# EAGLE design FabOptimusEdited (EAGLE 9.5.2)
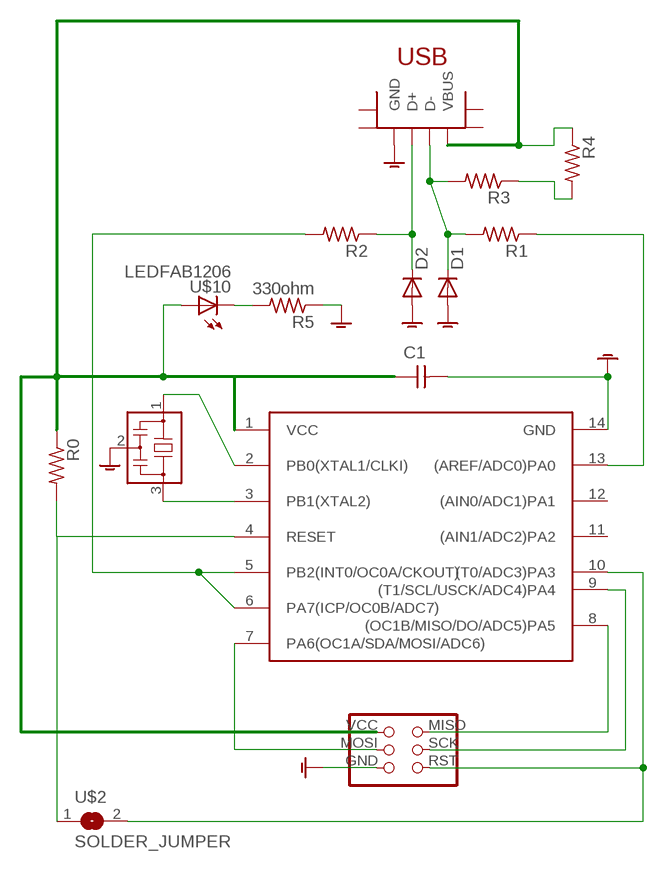
[diagram p0: schematic, sheet 1]

## Parts
C1  CAP-UNPOLARIZEDFAB  [C1206FAB]
D1  DIODESOD123  [SOD123]
D2  DIODESOD123  [SOD123]
IC1  ATTINY44-SSU  [SOIC14_ATTTINY44]
JP1  2X3PINHEADER  [2X3PINHEADER]
R0  RES-US1206FAB  [R1206FAB]
R1  RES-US1206FAB  [R1206FAB]
R2  RES-US1206FAB  [R1206FAB]
R3  RES-US1206FAB  [R1206FAB]
R4  RES-US1206FAB  [R1206FAB]
R5  330ohm  RES-US1206FAB  [R1206FAB]
U$1  RESONATOR  [EFOBM]
U$2  SOLDER_JUMPER  [SOLDERJUMPER]
U$8  USB_MINIB  [USB_MINIB]
U$10  LEDFAB1206  [LED1206FAB]

## Nets
GND: C1.2 D1.ANODE(A) D2.ANODE(A) IC1.14(GND) JP1.GND R5.1 U$1.2 U$8.GND
N$1: IC1.2(PB0(XTAL1/CLKI)) U$1.1
N$2: D2.CATHODE(C) R2.1 U$8.D+
N$3: IC1.9((T1/SCL/USCK/ADC4)PA4) JP1.SCK
N$4: D1.CATHODE(C) R1.2 R3.2 U$8.D-
N$5: IC1.7(PA6(OC1A/SDA/MOSI/ADC6)) JP1.MOSI
N$6: IC1.5(PB2(INT0/OC0A/CKOUT)) IC1.6(PA7(ICP/OC0B/ADC7)) R2.2
N$7: IC1.3(PB1(XTAL2)) U$1.3
N$8: IC1.13((AREF/ADC0)PA0) R1.1
N$9: IC1.8((OC1B/MISO/DO/ADC5)PA5) JP1.MISO
N$10: IC1.10((T0/ADC3)PA3) JP1.RST U$2.2
N$11: IC1.4(RESET) R0.2 U$2.1
N$12: R3.1 R4.2
N$14: R5.2 U$10.2(C)
R4: C1.1 IC1.1(VCC) JP1.VCC R0.1 R4.1 U$8.V(VBUS) U$10.1(A)
Unconnected: IC1.11((AIN1/ADC2)PA2) IC1.12((AIN0/ADC1)PA1) U$8.SHIELD@1(SHIELD) U$8.SHIELD@2(SHIELD1) U$8.SHIELD@3(SHIELD2) U$8.SHIELD@4(SHIELD3)

## Library data of the parts
C1 = fab:CAP-UNPOLARIZED
D1 D2 = fab:DIODE: DIODE high speed (Philips)
IC1 = myFab:ATTINY44
JP1 = myFab:2X3PINHEADER: PIN HEADER
R0 R1-R5 = fab:RES-US: Resistor (US Symbol) Variants with postfix FAB are widened to allow the routing of internal traces
U$1 = fab:RESONATOR
U$2 = myFab:SOLDER_JUMPER
U$8 = myFab:USB_MINIB
U$10 = fab:LED: LED

## Board
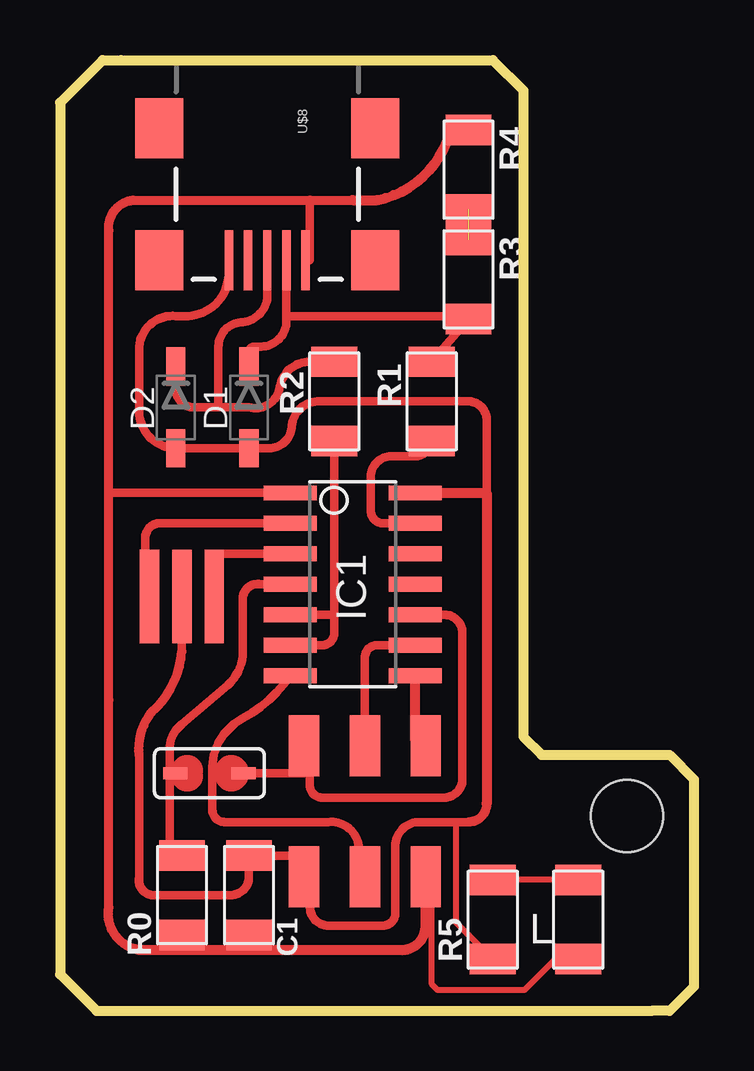
[diagram p1: board, top side]
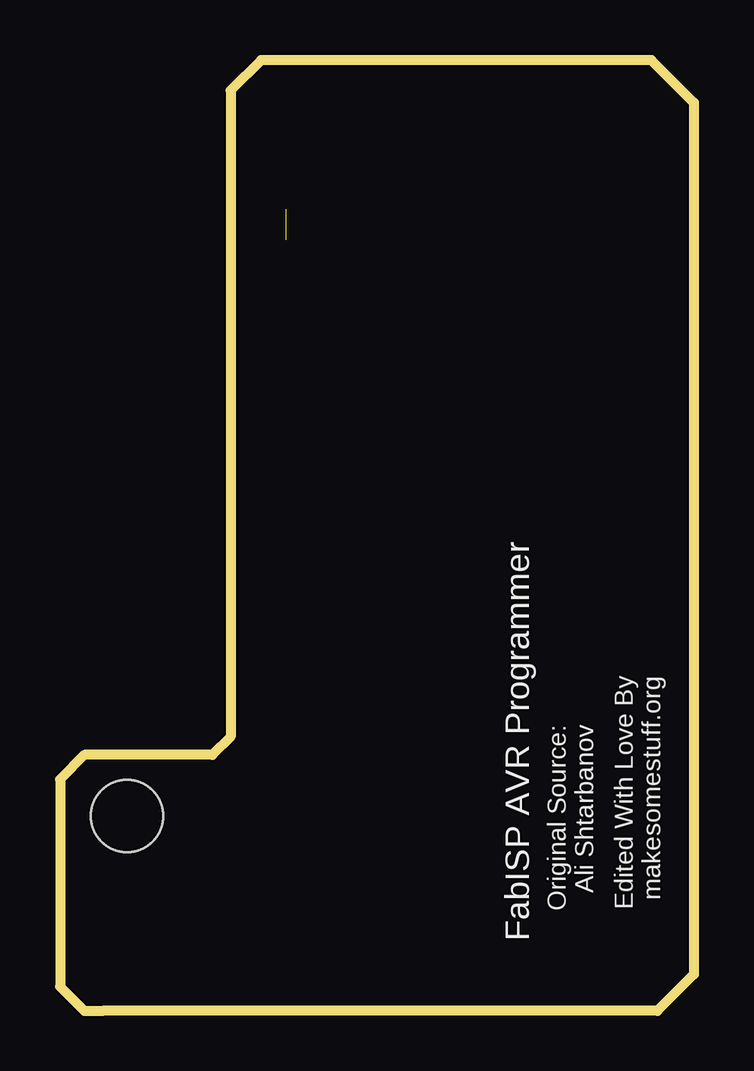
[diagram p2: board, bottom side, seen from below]

Size 26.42 x 39.62 mm. Coordinates in mm from the lower left corner, seen from the top.
Outline: 2.29,39.62 2.54,39.62
Outline: 2.54,39.62 18.03,39.62 19.3,38.35 19.3,11.43 20.07,10.67 25.4,10.67 26.42,9.65 26.42,1.02 25.4,0 24.64,0
Outline: 24.64,0 1.52,0 0,1.52 0,37.85 1.78,39.62 2.54,39.62
Outline: 24.64,0 24.89,0
Copper layers (1*16): Top 0.035mm / dielectric 1.5mm / Bottom 0.035mm
Design rules "fabcity-designrules": minimum track width 10mil, minimum drill 32mil, track to track 16mil, track to pad 16mil, pad to pad 16mil, via to via 16mil, smd to smd 6mil, copper to edge 16mil, drill to drill 16mil, minimum pad ring 10mil, minimum via ring 8mil, stop-mask expansion 4mil, vias tented up to drill 0mil, thermal gap 16mil
Holes 3 mm at 23.62,8.13

### Footprints (pad centres in the part's own frame; a part is rotated, then mirrored left to right if it is on the bottom)
C1206FAB = smd 1.27 x 1.905: 1 -1.651,0; 2 1.651,0
SOD123 = smd 1.6 x 0.8: ANODE 1.7,0; CATHODE -1.7,0
SOIC14_ATTTINY44 = smd 2.21 x 0.61: 1 -3.873,3.81; 2 -3.873,2.54; 3 -3.873,1.27; 4 -3.873,0; 5 -3.873,-1.27; 6 -3.873,-2.54; 7 -3.873,-3.81; 8 1.333,-3.81; 9 1.333,-2.54; 10 1.333,-1.27; 11 1.333,0; 12 1.333,1.27; 13 1.333,2.54; 14 1.333,3.81
2X3PINHEADER = smd 2.54 x 1.27: GND -2.54,2.54; MISO 2.92,-2.54; MOSI -2.54,0; RST 2.92,2.54; SCK 2.92,0; VCC -2.54,-2.54
R1206FAB = smd 1.27 x 1.905: 1 -1.651,0; 2 1.651,0
EFOBM = smd 0.8 x 3.9: 1 -1.35,0; 2 0,0; 3 1.35,0
SOLDERJUMPER = smd 1.016 x 0.508: 1 -2.057,0; 2 0.787,0
USB_MINIB = smd 2.5 x 0.35: D+ 3.77,0; D- 3.77,0.8; GND 3.77,-1.6; ID 3.77,-0.8; V 3.77,1.6 | smd 2.5 x 2: SHIELD@1 -1.73,-4.5; SHIELD@2 -1.73,4.5; SHIELD@3 3.77,4.5; SHIELD@4 3.77,-4.5
LED1206FAB = smd 1.27 x 1.905: 1 -1.651,0; 2 1.651,0

### Placement (x,y rotation side)
C1  7.87,4.83 90 top
D1  7.87,25.15 270 top
D2  4.83,25.15 270 top
IC1  13.46,17.78 0 top
JP1  12.7,8.13 90 top
R0  5.08,4.83 90 top
R1  15.49,25.4 90 top
R2  11.43,25.4 270 top
R3  17.02,30.48 270 top
R4  17.02,35.05 270 top
R5  18.03,3.81 90 top
U$1  5.08,17.27 0 top
U$2  6.86,9.91 0 top
U$8  8.64,35.05 270 top
U$10  21.59,3.81 90 top

### Tracks (layer width: path | path; a pad name or v marks a point on that pad's centre or on a via)
GND
  Top 0.254: R5.1 16.51,3.68 16.51,7.87
  Top 0.356: 15.49,21.59 IC1.14 | 17.02,7.87 16.51,7.87 14.99,7.87 arc90 13.97,6.86 13.97,4.06 arc-90 13.46,3.56 11.18,3.56 arc-90 10.41,4.32 10.41,4.57 arc90 10.16,4.83 arc90 9.91,4.83 | 3.3,10.67 3.3,5.59 arc90 3.81,4.83 7.11,4.83 arc90 7.87,5.59 C1.2 10.16,6.48 JP1.GND | 17.78,21.59 17.78,24.64 arc90 17.02,25.4 10.92,25.4 arc90 9.65,24.38 arc-90 8.71,23.45 D1.ANODE D2.ANODE arc-90 3.3,24.97 3.3,27.69 arc-90 4.83,28.96 5.33,28.96 arc62 6.86,29.97 arc29 U$8.GND | 5.08,14.99 U$1.2
  Top 0.381: 17.78,8.64 arc-90 17.02,7.87 | 3.3,10.67 arc-44 3.81,12.45 arc44 5.08,14.99
  Top 0.406: 10.16,4.83 JP1.GND | 17.78,8.64 17.78,21.59 15.49,21.59
N$1
  Top 0.356: IC1.2 4.06,20.32 arc90 3.56,19.56 3.56,17.1 arc-90 U$1.1
N$2
  Top 0.356: R2.1 10.54,27.05 arc90 9.14,25.91 arc-90 7.87,25.15 6.6,25.15 | D2.CATHODE 4.83,25.91 arc90 5.59,25.15 6.6,25.15 | U$8.D+ 8.64,29.97 arc-90 7.62,28.7 arc90 6.6,27.69 6.6,25.15
N$3
  Top 0.356: JP1.SCK 12.7,14.73 arc-90 13.21,15.24 IC1.9
N$4
  Top 0.356: D1.CATHODE 7.87,27.43 arc-90 8.13,27.69 8.38,27.69 arc90 9.44,28.74 9.44,28.96 | 9.44,28.96 U$8.D- | 9.44,28.96 16.76,28.96 R3.2 R1.2
N$5
  Top 0.356: 9.14,13.97 IC1.7 arc-28 7.62,12.19 arc34 6.6,11.18 arc28 6.35,10.16 6.35,8.38 arc90 6.86,7.87 11.18,7.87 arc-90 12.45,6.86 JP1.MOSI
N$6
  Top 0.356: IC1.5 11.43,16.51 | 11.43,16.51 11.43,16 11.43,15.75 arc-90 10.92,15.24 IC1.6 | R2.2 11.43,16.51
N$7
  Top 0.356: IC1.3 6.35,19.05 6.35,17.35 arc90 U$1.3
N$8
  Top 0.356: IC1.13 13.46,20.32 arc-90 12.95,20.83 12.95,22.1 arc-90 13.72,23.11 14.61,23.11 arc90 R1.1
N$9
  Top 0.406: JP1.MISO 14.8,11.3 IC1.8
N$10
  Top 0.356: IC1.10 16,16.51 arc-90 16.76,15.75 16.76,9.65 arc-90 16,8.89 10.92,8.89 arc-90 10.41,9.4 10.41,10.79 arc90 JP1.RST 10.16,9.91 U$2.2
  Top 0.406: JP1.RST 10.44,11.05
N$11
  Top 0.356: IC1.4 8.38,17.78 arc90 7.62,17.27 7.62,14.99 arc-53 6.86,13.46 5.08,11.94 arc53 4.57,10.92 4.57,10.14 | 4.57,10.14 4.57,6.98 arc90 R0.2 | 4.57,10.14 arc90 U$2.1
N$12  (1 unrouted)
N$14
  Top 0.254: U$10.2 R5.2
R4
  Top 0.254: U$10.1 20.63,2.16 19.33,0.86 15.75,0.86 15.49,1.12 15.49,5.33 JP1.VCC
  Top 0.356: R0.1 5.33,2.54 | IC1.1 2.03,21.59 | C1.1 7.87,2.54 | U$8.V 10.41,31.28 10.41,33.78
  Top 0.368: 2.03,12.95 2.03,21.59 2.03,32.51 arc-90 3.05,33.78
  Top 0.381: 3.05,33.78 10.41,33.78 12.19,33.78 | 3.3,2.54 arc-90 2.03,4.32 2.03,12.95
  Top 0.406: JP1.VCC 15.24,3.56 arc-90 14.22,2.54 7.87,2.54 5.33,2.54 3.3,2.54 | R4.1 arc161 16.26,36.58 arc-62 13.21,33.78 12.19,33.78

### Text on the board
tPlace: L
bPlace: FabISP AVR Programmer | Edited With Love By / makesomestuff.org | Original Source: / Ali Shtarbanov
Labels: USB | R_pullup | C | C | D / 3.3V | D / 3.3V | 100Ω | 100Ω | A | A | 20 / MHz | ATTiny44 | 0Ω | ISP | 10K | 1μF | LED_RES | LED_1206